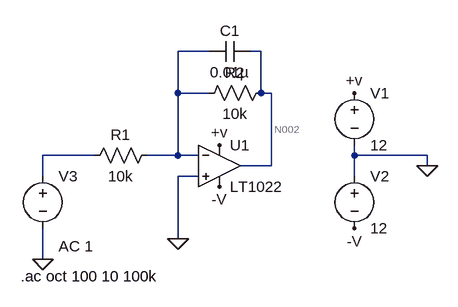
[diagram p0: schematic Draft14.asc]
Draft14.asc, the LTspice schematic file:
Version 4
SHEET 1 880 680
WIRE 192 0 144 0
WIRE 272 0 256 0
WIRE 144 64 144 0
WIRE 192 64 144 64
WIRE 272 64 272 0
WIRE 288 64 272 64
WIRE 16 160 -64 160
WIRE 144 160 144 64
WIRE 144 160 96 160
WIRE 176 160 144 160
WIRE 416 160 416 144
WIRE 528 160 416 160
WIRE 288 176 288 64
WIRE 288 176 240 176
WIRE 528 176 528 160
WIRE -64 192 -64 160
WIRE 176 192 144 192
WIRE 416 192 416 160
WIRE 144 288 144 192
WIRE -64 320 -64 272
FLAG -64 320 0
FLAG 144 288 0
FLAG 528 176 0
FLAG 208 144 +v
FLAG 416 64 +v
FLAG 208 208 -V
FLAG 416 272 -V
SYMBOL voltage 416 48 R0
SYMATTR InstName V1
SYMATTR Value 12
SYMBOL voltage 416 176 R0
SYMATTR InstName V2
SYMATTR Value 12
SYMBOL voltage -64 176 R0
WINDOW 123 24 124 Left 2
WINDOW 39 0 0 Left 0
SYMATTR InstName V3
SYMATTR Value ""
SYMATTR Value2 AC 1
SYMBOL res 112 144 R90
WINDOW 0 0 56 VBottom 2
WINDOW 3 32 56 VTop 2
SYMATTR InstName R1
SYMATTR Value 10k
SYMBOL res 288 48 R90
WINDOW 0 0 56 VBottom 2
WINDOW 3 32 56 VTop 2
SYMATTR InstName R2
SYMATTR Value 10k
SYMBOL Opamps\\LT1022 208 112 R0
SYMATTR InstName U1
SYMBOL cap 256 -16 R90
WINDOW 0 0 32 VBottom 2
WINDOW 3 32 32 VTop 2
SYMATTR InstName C1
SYMATTR Value 0.01µ
TEXT -98 346 Left 2 !.ac oct 100 10 100k

The netlist it stands for:
* Draft14.asc
V1 +v 0 12
V2 0 -V 12
V3 N003 0 AC 1
R1 N001 N003 10k
R2 N002 N001 10k
XU1 0 N001 +v -V N002 LT1022  ; pins In+ In- V+ V- OUT
C1 N002 N001 0.01µ
.ac oct 100 10 100k
.backanno
.end

* Results of the author's LTspice run, read from the files saved beside the schematic
* Operating Point, zero values left out:
*   V(+v) = 12 V
*   V(-v) = -12 V
*   I(V2) = -5.2 mA
*   I(V1) = -5.2 mA
*   Ix(u1:3) = 5.2 mA
*   Ix(u1:4) = -5.2 mA
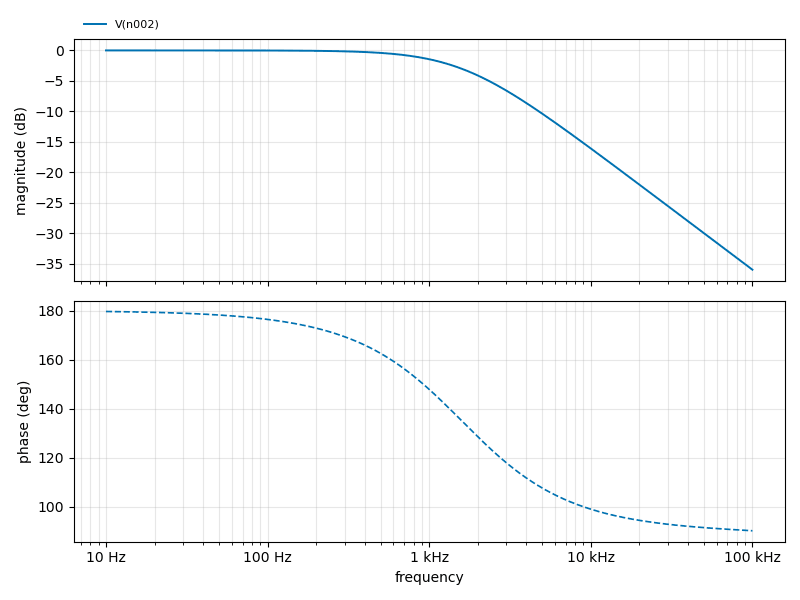
[diagram p1: AC Analysis of Draft14.asc, plotted from the saved traces]
* AC Analysis, 1 run:
*   V(n002): -0.00 dB at 10 Hz, -35.95 dB at 100 kHz, peak -0.00 dB at 10 Hz, 3 dB below the peak at 1.591 kHz